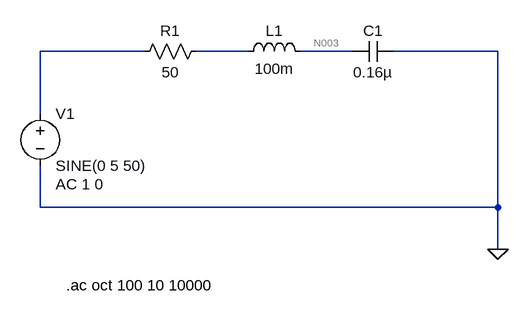
[diagram p0: schematic rlc-seriese.asc]
rlc-seriese.asc, the LTspice schematic file:
Version 4.1
SHEET 1 880 680
WIRE 80 64 -80 64
WIRE 240 64 160 64
WIRE 400 64 320 64
WIRE 624 64 464 64
WIRE -80 160 -80 64
WIRE -80 304 -80 240
WIRE 624 304 624 64
WIRE 624 304 -80 304
WIRE 624 368 624 304
FLAG 624 368 0
SYMBOL voltage -80 144 R0
WINDOW 123 24 124 Left 2
WINDOW 39 0 0 Left 0
SYMATTR InstName V1
SYMATTR Value SINE(0 5 50)
SYMATTR Value2 AC 1 0
SYMBOL res 176 48 R90
WINDOW 0 0 56 VBottom 2
WINDOW 3 32 56 VTop 2
SYMATTR InstName R1
SYMATTR Value 50
SYMBOL ind 224 80 R270
WINDOW 0 32 56 VTop 2
WINDOW 3 5 56 VBottom 2
SYMATTR InstName L1
SYMATTR Value 100m
SYMBOL cap 400 80 R270
WINDOW 0 32 32 VTop 2
WINDOW 3 0 32 VBottom 2
SYMATTR InstName C1
SYMATTR Value 0.16µ
TEXT -40 424 Left 2 !.ac oct 100 10 10000

The netlist it stands for:
* rlc-seriese.asc
V1 N001 0 SINE(0 5 50) AC 1 0
R1 N002 N001 50
L1 N002 N003 100m
C1 N003 0 0.16µ
.ac oct 100 10 10000
.backanno
.end

* Results of the author's LTspice run, read from the files saved beside the schematic
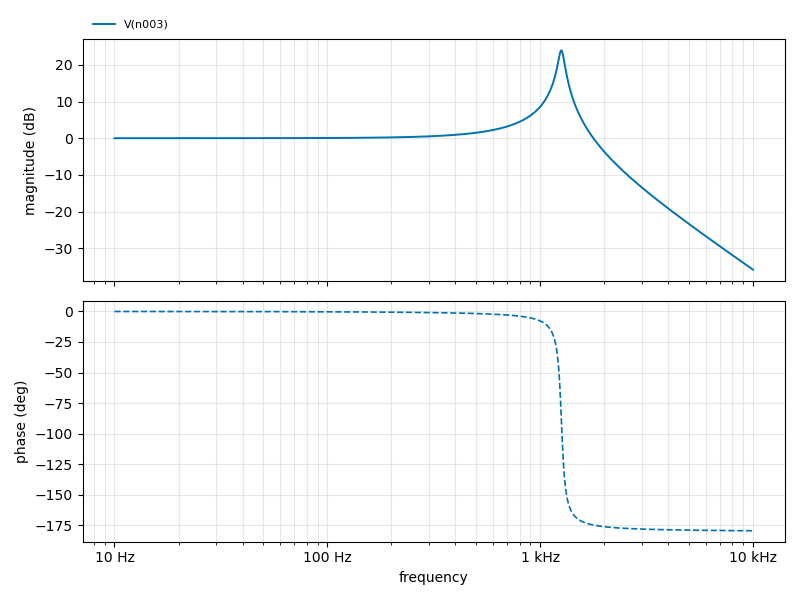
[diagram p1: AC Analysis of rlc-seriese.asc, plotted from the saved traces]
* AC Analysis, 1 run:
*   V(n003): 0.00 dB at 10 Hz, -35.87 dB at 10 kHz, peak 23.95 dB at 1.254 kHz, 3 dB below the peak at 1.216 kHz and 1.296 kHz